# Altium schematic sheet RP2040T.SchDoc
size A4; SheetNumber: 1; SheetTotal: 1
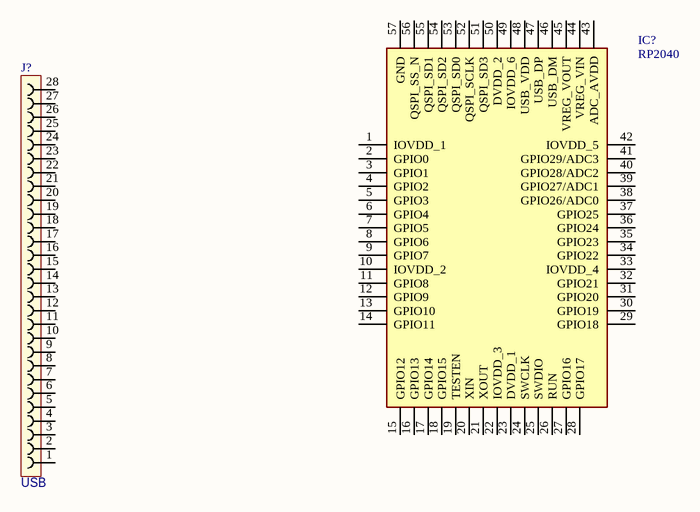
[diagram p0: RP2040T.SchDoc]

## Parts
IC?  RP2040  [QFN40P700X700X90-57N-D]
J?  SCH_VALUE: USB  [CON_12551AF06_SMT_28P]  (hidden comment: CON_FEM-1R_28P_EU)

## Nets

Not connected (* = marked no-connect by the designer): IC? 1(IOVDD_1) 2(GPIO0) 3(GPIO1) 4(GPIO2) 5(GPIO3) 6(GPIO4) 7(GPIO5) 8(GPIO6) 9(GPIO7) 10(IOVDD_2) 11(GPIO8) 12(GPIO9) 13(GPIO10) 14(GPIO11) 15(GPIO12) 16(GPIO13) 17(GPIO14) 18(GPIO15) 19(TESTEN) 20(XIN) 21(XOUT) 22(IOVDD_3) 23(DVDD_1) 24(SWCLK) 25(SWDIO) 26(RUN) 27(GPIO16) 28(GPIO17) 29(GPIO18) 30(GPIO19) 31(GPIO20) 32(GPIO21) 33(IOVDD_4) 34(GPIO22) 35(GPIO23) 36(GPIO24) 37(GPIO25) 38(GPIO26/ADC0) 39(GPIO27/ADC1) 40(GPIO28/ADC2) 41(GPIO29/ADC3) 42(IOVDD_5) 43(ADC_AVDD) 44(VREG_VIN) 45(VREG_VOUT) 46(USB_DM) 47(USB_DP) 48(USB_VDD) 49(IOVDD_6) 50(DVDD_2) 51(QSPI_SD3) 52(QSPI_SCLK) 53(QSPI_SD0) 54(QSPI_SD2) 55(QSPI_SD1) 56(QSPI_SS_N) 57(GND); J? 1 2 3 4 5 6 7 8 9 10 11 12 13 14 15 16 17 18 19 20 21 22 23 24 25 26 27 28

## Library data of the parts
IC? = RP2040: Integrated Circuit; Manufacturer_Name: RASPBERRY-PI; Datasheet Link: https://datasheets.raspberrypi.org/rp2040/rp2040-datasheet.pdf; Height: 0.9mm; Manufacturer_Part_Number: RP2040
J? = 12551AF06: CONN^SM 24PIN USB C RECEP HORIZ; SUBTYPE: FEM-1R; LIB_STATE: NEW; SCH_TOLERANCE: *; SCH_RATING: *; SCH_PACKAGE: *; CPN: 12551AF06